# Altium project CartApuce.PrjPcb (part 2 of 2)

## Sheet CaP_CDC.SchDoc
size A2; Author: Audran; CompanyName: Goldorak; Address1: Electrolab; Address2: 52 rue Paul Lescop; Address3: 92000 Nanterre; ProjectName: Cartes_2017
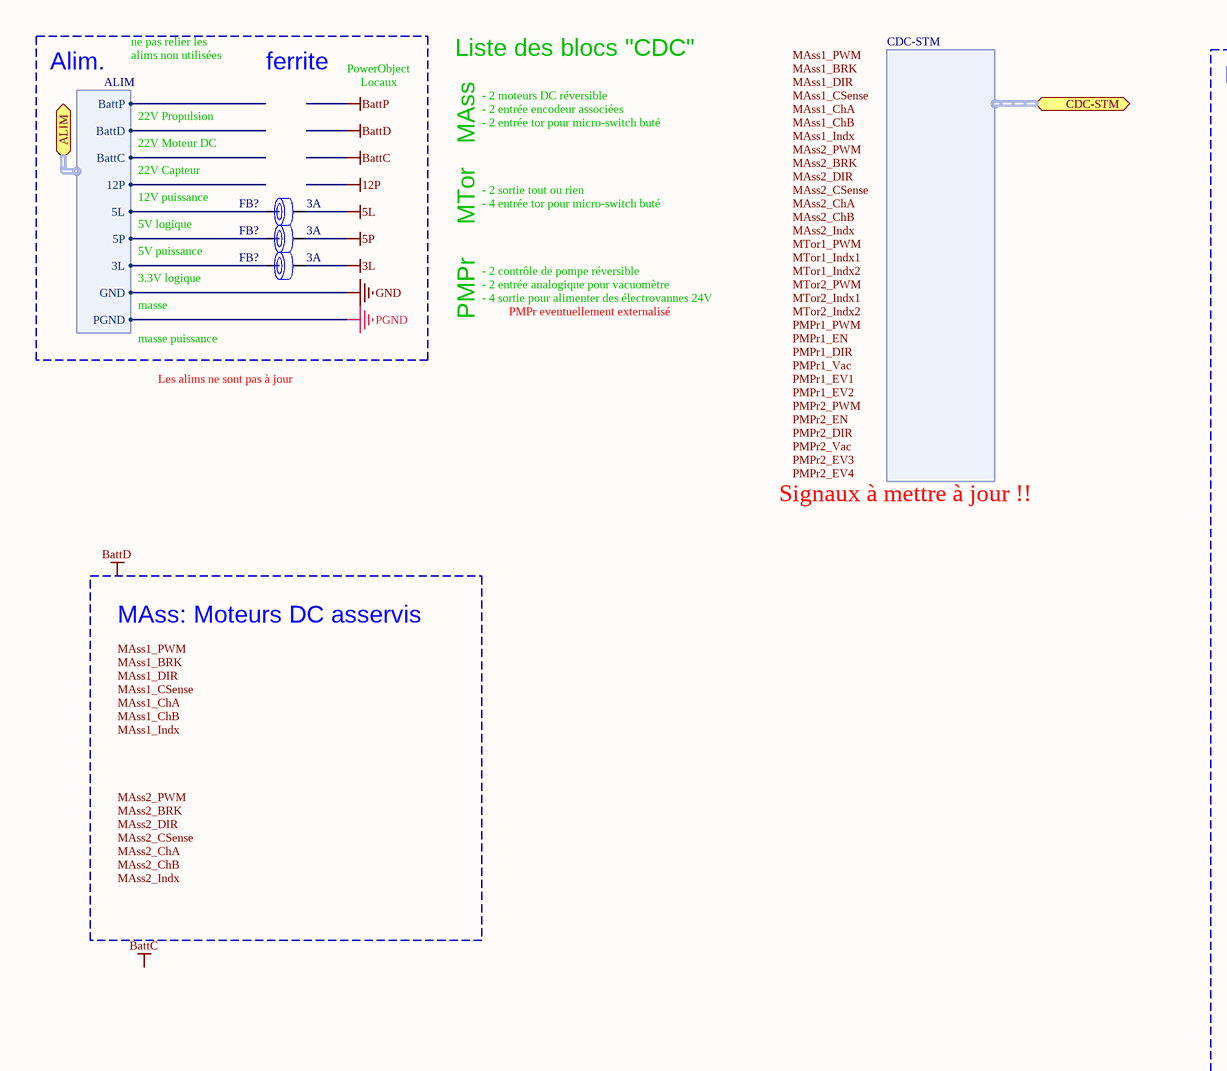
[diagram p4: CaP_CDC.SchDoc, left]
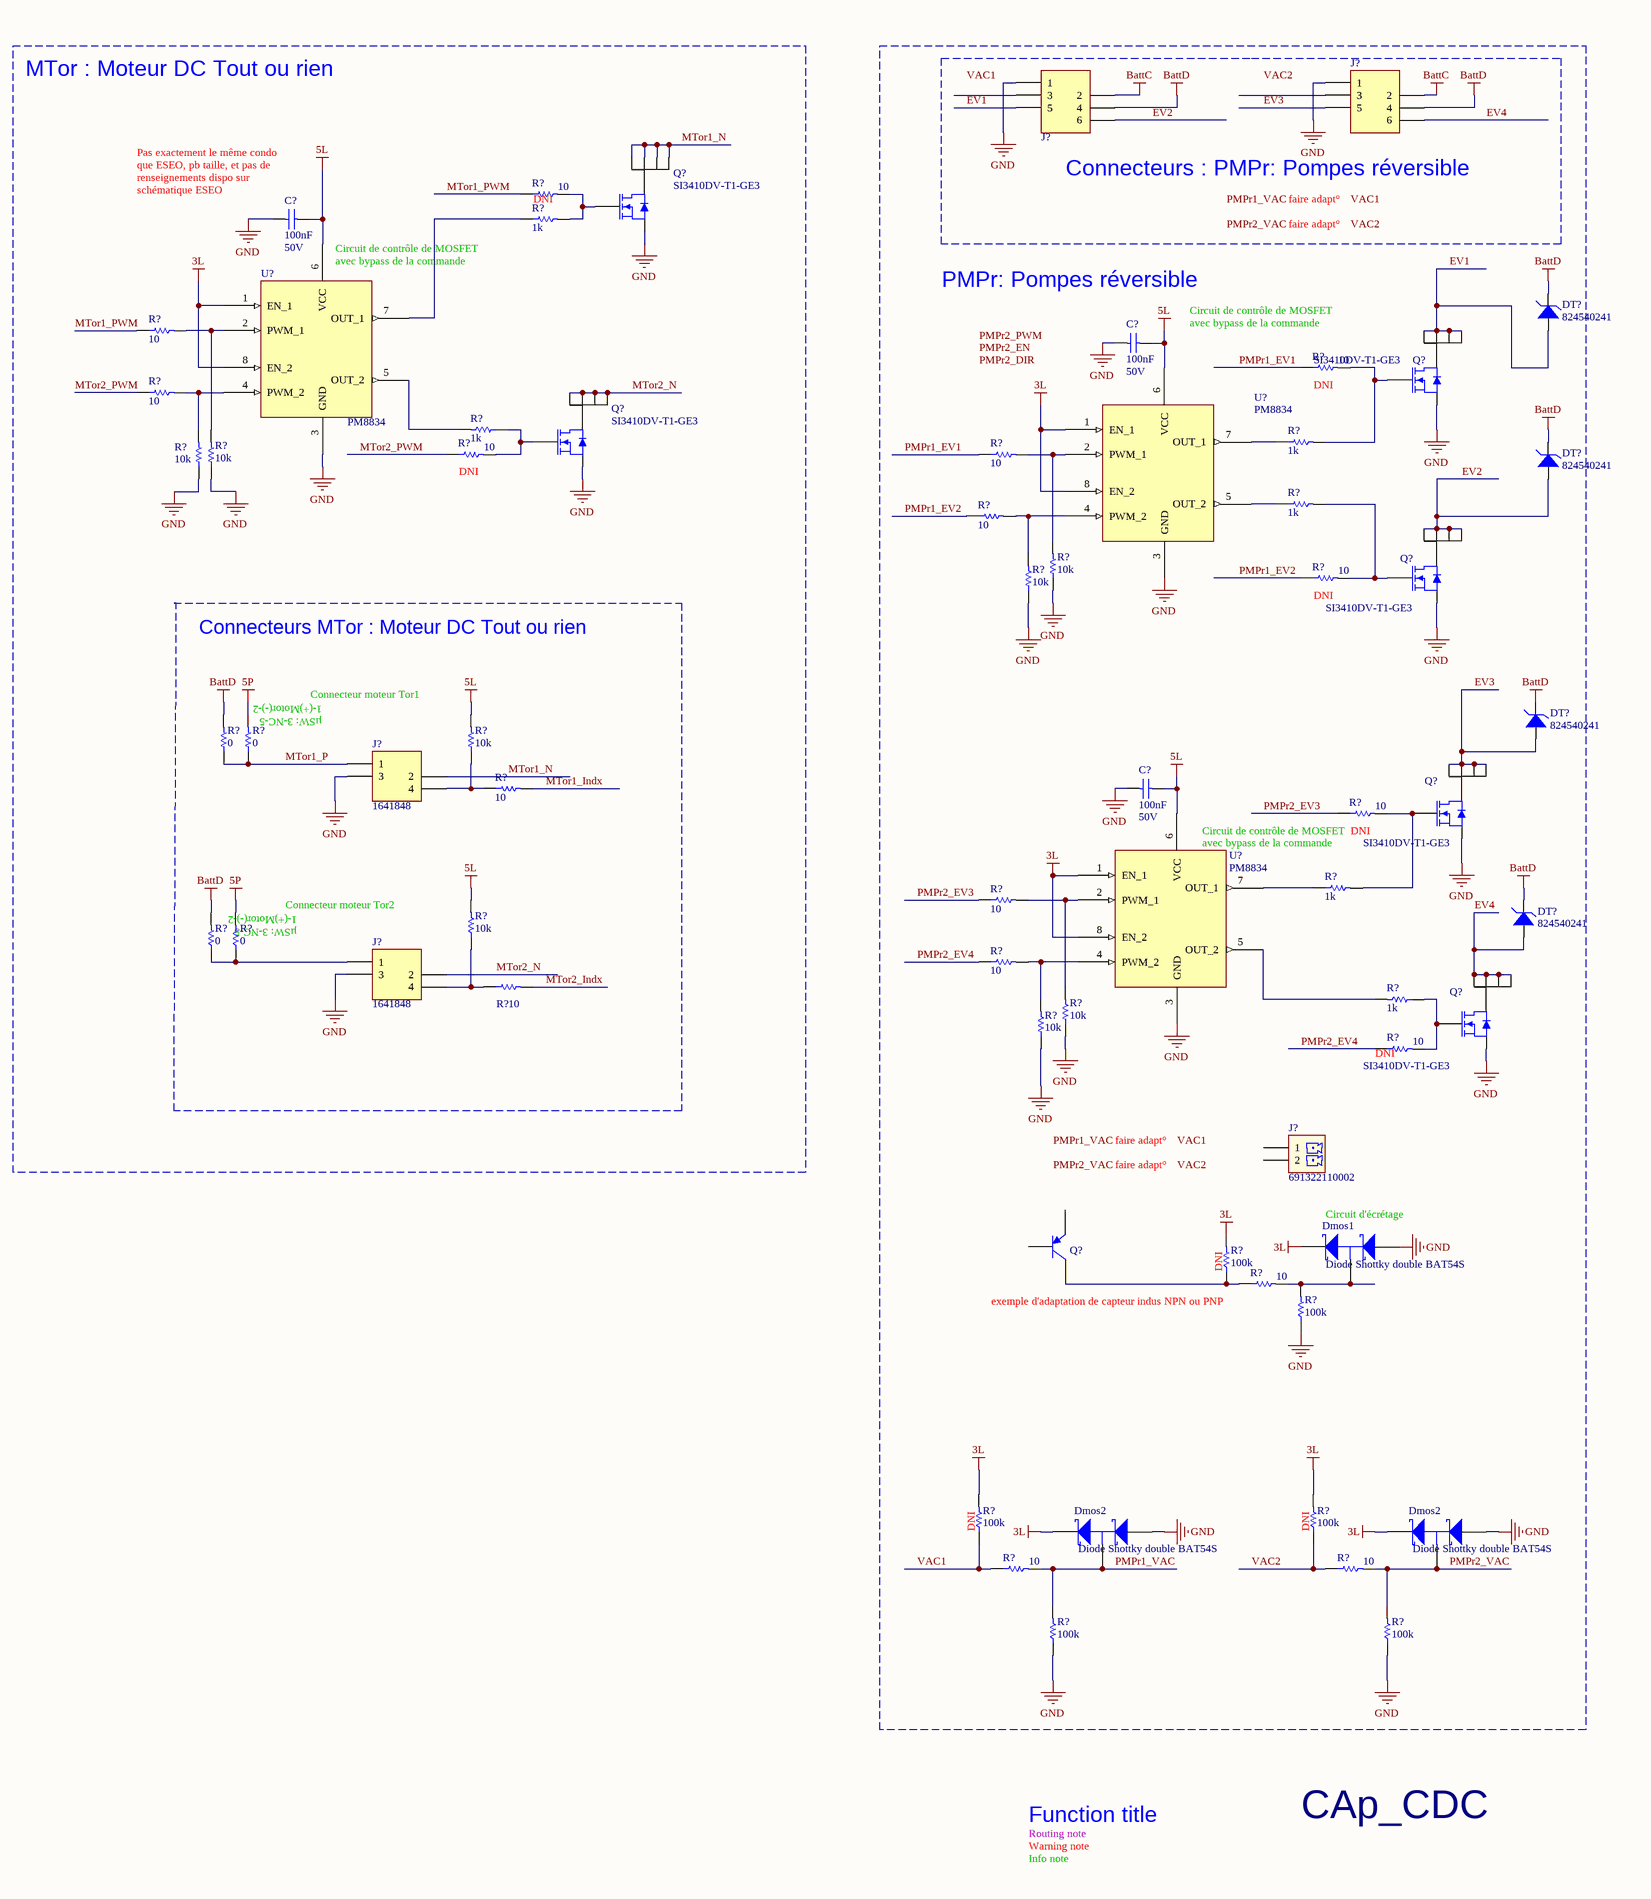
[diagram p5: CaP_CDC.SchDoc, right]

### Parts
(Parts that share a designator on the sheet are numbered #1, #2 ... from top to bottom, then left to right.)
C?#16  100nF  RatedVoltage: 50V  [WCAP-CSGP_0603, 1.6x0.8x0.8]
C?#17  100nF  RatedVoltage: 50V  [WCAP-CSGP_0603, 1.6x0.8x0.8]
C?#18  100nF  RatedVoltage: 50V  [WCAP-CSGP_0603, 1.6x0.8x0.8]
Dmos1  Diode Shottky double BAT54S  [SOT23-3N]
Dmos2#1  Diode Shottky double BAT54S  [SOT23-3N]
Dmos2#2  Diode Shottky double BAT54S  [SOT23-3N]
DT?#1  824540241  [DO-214AB_Unidirectional]
DT?#2  824540241  [DO-214AB_Unidirectional]
DT?#3  824540241  [DO-214AB_Unidirectional]
DT?#4  824540241  [DO-214AB_Unidirectional]
FB?#1  RatedCurrent: 3A  [WE-CBF_0805_High Current]  (hidden comment: 742792023)
FB?#2  RatedCurrent: 3A  [WE-CBF_0805_High Current]  (hidden comment: 742792023)
FB?#3  RatedCurrent: 3A  [WE-CBF_0805_High Current]  (hidden comment: 742792023)
J?#2  690367280676  [690367280676]  (value not drawn)
J?#3  690367280676  [690367280676]  (value not drawn)
J?#4  Supplier Part Number 1: 1641848  [690367280476]  (hidden comment: 690367280476)
J?#5  Supplier Part Number 1: 1641848  [690367280476]  (hidden comment: 690367280476)
J?#6  691322110002  [691322110002]
Q?#1  SI3410DV-T1-GE3  [TSOP95P280X110-6N]
Q?#2  SI3410DV-T1-GE3  [TSOP95P280X110-6N]
Q?#3  SI3410DV-T1-GE3  [TSOP95P280X110-6N]
Q?#4  SI3410DV-T1-GE3  [TSOP95P280X110-6N]
Q?#5  SI3410DV-T1-GE3  [TSOP95P280X110-6N]
Q?#6  SI3410DV-T1-GE3  [TSOP95P280X110-6N]
Q?#7  NSS20200LT1G  [SOT-23]  (value not drawn)
R?#42  value 10  [RESC1005X04N]  (hidden comment: RC0402FR-0710RL)
R?#43  value 1k  [RESC1608X06N]  (hidden comment: RC0603FR-071KL)
R?#44  value 10  [RESC1005X04N]  (hidden comment: RC0402FR-0710RL)
R?#45  value 10  [RESC1005X04N]  (hidden comment: RC0402FR-0710RL)
R?#46  value 10  [RESC1005X04N]  (hidden comment: RC0402FR-0710RL)
R?#47  value 1k  [RESC1608X06N]  (hidden comment: RC0603FR-071KL)
R?#48  value 1k  [RESC1005X04N]  (hidden comment: RC0402FR-071KL)
R?#49  value 10  [RESC1005X04N]  (hidden comment: RC0402FR-0710RL)
R?#50  value 10  [RESC1005X04N]  (hidden comment: RC0402FR-0710RL)
R?#51  value 10k  [RESC1005X04N]  (hidden comment: RC0402FR-0710KL)
R?#52  value 10k  [RESC1005X04N]  (hidden comment: RC0402FR-0710KL)
R?#53  value 1k  [RESC1005X04N]  (hidden comment: RC0402FR-071KL)
R?#54  value 10  [RESC1005X04N]  (hidden comment: RC0402FR-0710RL)
R?#55  value 10  [RESC1005X04N]  (hidden comment: RC0402FR-0710RL)
R?#56  value 10k  [RESC1005X04N]  (hidden comment: RC0402FR-0710KL)
R?#57  value 10k  [RESC1005X04N]  (hidden comment: RC0402FR-0710KL)
R?#58  value 0  [RESC1005X04N]  (hidden comment: RC0402JR-070RL)
R?#59  value 0  [RESC1005X04N]  (hidden comment: RC0402JR-070RL)
R?#60  value 10k  [RESC1005X04N]  (hidden comment: RC0402FR-0710KL)
R?#61  value 10  [RESC1005X04N]  (hidden comment: RC0402FR-0710RL)
R?#62  value 10  [RESC1005X04N]  (hidden comment: RC0402FR-0710RL)
R?#63  value 1k  [RESC1005X04N]  (hidden comment: RC0402FR-071KL)
R?#64  value 10  [RESC1005X04N]  (hidden comment: RC0402FR-0710RL)
R?#65  value 10k  [RESC1005X04N]  (hidden comment: RC0402FR-0710KL)
R?#66  value 0  [RESC1005X04N]  (hidden comment: RC0402JR-070RL)
R?#67  value 0  [RESC1005X04N]  (hidden comment: RC0402JR-070RL)
R?#68  value 10  [RESC1005X04N]  (hidden comment: RC0402FR-0710RL)
R?#69  value 10  [RESC1005X04N]  (hidden comment: RC0402FR-0710RL)
R?#70  value 1k  [RESC1608X06N]  (hidden comment: RC0603FR-071KL)
R?#71  value 10k  [RESC1005X04N]  (hidden comment: RC0402FR-0710KL)
R?#72  value 10k  [RESC1005X04N]  (hidden comment: RC0402FR-0710KL)
R?#73  value 10  [RESC1005X04N]  (hidden comment: RC0402FR-0710RL)
R?#74  value 100k  [RESC1608X06N]  (hidden comment: RC0603FR-07100KL)
R?#75  value 10  [RESC1005X04N]  (hidden comment: RC0402FR-0710RL)
R?#76  value 100k  [RESC1608X06N]  (hidden comment: RC0603FR-07100KL)
R?#77  value 100k  [RESC1608X06N]  (hidden comment: RC0603FR-07100KL)
R?#78  value 100k  [RESC1608X06N]  (hidden comment: RC0603FR-07100KL)
R?#79  value 10  [RESC1005X04N]  (hidden comment: RC0402FR-0710RL)
R?#80  value 10  [RESC1005X04N]  (hidden comment: RC0402FR-0710RL)
R?#81  value 100k  [RESC1608X06N]  (hidden comment: RC0603FR-07100KL)
R?#82  value 100k  [RESC1608X06N]  (hidden comment: RC0603FR-07100KL)
U?#1  PM8834  [SOIC127P600X175-8N]
U?#2  PM8834  [SOIC127P600X175-8N]
U?#3  PM8834  [SOIC127P600X175-8N]

### Blocks framed on the sheet
PMPr: Pompes réversible: C?#17 C?#18 Dmos1 Dmos2#1 Dmos2#2 DT?#1-DT?#4 J?#6 Q?#2 Q?#4-Q?#7 R?#45 R?#48 R?#50 R?#53-R?#57 R?#62-R?#64 R?#68 R?#70-R?#82 U?#2 U?#3
Connecteurs : PMPr: Pompes réversible: J?#2 J?#3
Connecteurs MTor : Moteur DC Tout ou rien: J?#4 J?#5 R?#58-R?#61 R?#65-R?#67 R?#69

### Ports
ALIM (harness ALIM), CDC-STM (harness CDC-STM)

### Harnesses
CDC-STM: 
ALIM: BattP, BattD, BattC, 12P, 5L, 5P, 3L, GND, PGND

### Nets
3L: Dmos1.2(K) Dmos2#1.2(K) Dmos2#2.2(K) FB?#3.2 R?#74.2 R?#77.2 R?#78.2 U?#1.1(EN_1) U?#1.8(EN_2) U?#2.1(EN_1) U?#2.8(EN_2) U?#3.1(EN_1) U?#3.8(EN_2)
5L: C?#16.2 C?#17.2 C?#18.2 FB?#1.2 R?#60.2 R?#65.2 U?#1.6(VCC) U?#2.6(VCC) U?#3.6(VCC)
5P: FB?#2.2 R?#59.2 R?#67.2
BattC: J?#2.2 J?#3.2
BattD: DT?#1.2 DT?#2.2 DT?#3.2 DT?#4.2 J?#2.4 J?#3.4 R?#58.2 R?#66.2
GND: C?#16.1 C?#17.1 C?#18.1 Dmos1.1(A) Dmos2#1.1(A) Dmos2#2.1(A) J?#2.1 J?#3.1 J?#4.3 J?#5.3 Q?#1.4(S) Q?#2.4(S) Q?#3.4(S) Q?#4.4(S) Q?#5.4(S) Q?#6.4(S) R?#51.1 R?#52.1 R?#56.1 R?#57.1 R?#71.1 R?#72.1 R?#76.1 R?#81.1 R?#82.1 U?#1.3(GND) U?#2.3(GND) U?#3.3(GND) ; port ALIM.GND
EV1: DT?#1.1 J?#2.5 Q?#2.1(D) Q?#2.2(D) Q?#2.5(D) Q?#2.6(D)
EV2: DT?#2.1 J?#2.6 Q?#4.1(D) Q?#4.2(D) Q?#4.5(D) Q?#4.6(D)
EV3: DT?#3.1 J?#3.5 Q?#5.1(D) Q?#5.2(D) Q?#5.5(D) Q?#5.6(D)
EV4: DT?#4.1 J?#3.6 Q?#6.1(D) Q?#6.2(D) Q?#6.5(D) Q?#6.6(D)
MTor1_Indx: R?#61.2
MTor1_N: J?#4.2 Q?#1.1(D) Q?#1.2(D) Q?#1.5(D) Q?#1.6(D)
MTor1_P: J?#4.1 R?#58.1 R?#59.1
MTor1_PWM: R?#42.1 R?#44.1
MTor2_Indx: R?#69.2
MTor2_N: J?#5.2 Q?#3.1(D) Q?#3.2(D) Q?#3.5(D) Q?#3.6(D)
MTor2_PWM: R?#46.1 R?#49.1
PMPr1_EV1: R?#45.1 R?#50.1
PMPr1_EV2: R?#54.1 R?#55.1
PMPr1_VAC: Dmos2#1.3(C) R?#79.2 R?#81.2
PMPr2_EV3: R?#62.1 R?#64.1
PMPr2_EV4: R?#68.1 R?#73.1
PMPr2_VAC: Dmos2#2.3(C) R?#80.2 R?#82.2
VAC1: R?#77.1 R?#79.1
VAC2: R?#78.1 R?#80.1
NetDmos1_3: Dmos1.3(C) R?#75.2 R?#76.2
NetFB?#1_1: FB?#1.1 ; port ALIM.5L
NetFB?#2_1: FB?#2.1 ; port ALIM.5P
NetFB?#3_1: FB?#3.1 ; port ALIM.3L
NetJ?#4_4: J?#4.4 R?#60.1 R?#61.1
NetJ?#5_1: J?#5.1 R?#66.1 R?#67.1
NetJ?#5_4: J?#5.4 R?#65.1 R?#69.1
NetQ?#1_3: Q?#1.3(G) R?#42.2 R?#43.2
NetQ?#2_3: Q?#2.3(G) R?#45.2 R?#48.2
NetQ?#3_3: Q?#3.3(G) R?#47.1 R?#49.2
NetQ?#4_3: Q?#4.3(G) R?#53.2 R?#55.2
NetQ?#5_3: Q?#5.3(G) R?#62.2 R?#63.2
NetQ?#6_3: Q?#6.3(G) R?#70.1 R?#73.2
NetQ?#7_3: Q?#7.3(C) R?#74.1 R?#75.1
NetR?#43_1: R?#43.1 U?#1.7(OUT_1)
NetR?#44_2: R?#44.2 R?#52.2 U?#1.2(PWM_1)
NetR?#46_2: R?#46.2 R?#51.2 U?#1.4(PWM_2)
NetR?#47_2: R?#47.2 U?#1.5(OUT_2)
NetR?#48_1: R?#48.1 U?#2.7(OUT_1)
NetR?#50_2: R?#50.2 R?#56.2 U?#2.2(PWM_1)
NetR?#53_1: R?#53.1 U?#2.5(OUT_2)
NetR?#54_2: R?#54.2 R?#57.2 U?#2.4(PWM_2)
NetR?#63_1: R?#63.1 U?#3.7(OUT_1)
NetR?#64_2: R?#64.2 R?#71.2 U?#3.2(PWM_1)
NetR?#68_2: R?#68.2 R?#72.2 U?#3.4(PWM_2)
NetR?#70_2: R?#70.2 U?#3.5(OUT_2)

Not connected (* = marked no-connect by the designer): J?#2 3; J?#3 3; J?#6 1 2; Q?#7 1(B) 2(E)

### Notes on the sheet
- Alim.
- ne pas relier les
- alims non utilisées
- ferrite
- PowerObject
- Locaux
- Liste des blocs "CDC"
- - 2 moteurs DC réversible
- MTor : Moteur DC Tout ou rien
- 22V Propulsion
- 22V Moteur DC
- - 2 entrée encodeur associées
- - 2 entrée tor pour micro-switch buté
- MAss
- 5V logique
- 12V puissance
- 22V Capteur
- - 2 sortie tout ou rien
- - 4 entrée tor pour micro-switch buté
- MTor
- (near C?#16) Pas exactement le même condo que ESEO, pb taille, et pas de renseignements dispo sur schématique ESEO
- (near R?#42) DNI
- faire adapt°
- 5V puissance
- 3.3V logique
- - 2 contrôle de pompe réversible
- - 2 entrée analogique pour vacuomètre
- - 4 sortie pour alimenter des électrovannes 24V
- (near U?#1) Circuit de contrôle de MOSFET
- (near U?#1) avec bypass de la commande
- masse
- masse puissance
- PMPr
- PMPr eventuellement externalisé
- Circuit de contrôle de MOSFET
- avec bypass de la commande
- Les alims ne sont pas à jour
- (near R?#45) DNI
- Signaux à mettre à jour !!
- (near R?#49) DNI
- MAss: Moteurs DC asservis
- (near R?#55) DNI
- Connecteur moteur Tor1
- 1-(+)Motor(-)-2
- (near J?#4) µSW: 3-NC-5
- (near R?#62) DNI
- (near U?#3) avec bypass de la commande
- Connecteur moteur Tor2
- (near J?#5) 1-(+)Motor(-)-2
- (near J?#5) µSW: 3-NC-5
- (near R?#73) DNI
- (near R?#74) DNI
- (near Dmos1) Circuit d'écrétage
- (near R?#75) exemple d'adaptation de capteur indus NPN ou PNP
- (near R?#77) DNI
- (near R?#78) DNI
- Function title
- CAp_CDC
- Routing note
- Warning note
- Info note
- Labels drawn without touching a wire or pin: BattC, BattD, MAss1_BRK, MAss1_ChA, MAss1_ChB, MAss1_CSense, MAss1_DIR, MAss1_Indx, MAss1_PWM, MAss2_BRK, MAss2_ChA, MAss2_ChB, MAss2_CSense, MAss2_DIR, MAss2_Indx, MAss2_PWM, MTor1_Indx1, MTor1_Indx2, MTor1_PWM, MTor2_Indx1, MTor2_Indx2, MTor2_PWM, PMPr1_DIR, PMPr1_EN, PMPr1_EV1, PMPr1_EV2, PMPr1_PWM, PMPr1_Vac, PMPr1_VAC, PMPr2_DIR, PMPr2_EN, PMPr2_EV3, PMPr2_EV4, PMPr2_PWM, PMPr2_VAC, PMPr2_Vac, VAC1, VAC2

### Library data of the parts
C?#16-C?#18 = WCAP-CSGP, 885012206095: CAP CER 100nF 50V X7R 0603; Manufacturer: Wurth Elektronik; PublishedDate: Aug 2016; ComponentLink1Description: Manufacturer; ComponentLink1URL: http://www.we-online.de; ComponentLink2Description: Datasheet; ComponentLink2URL: http://katalog.we-online.com/pbs/datasheet/885012206095.pdf; Manufacturer Part Number: 885012206095; Value: 100nF; Size: 0603; CeramicType: X7R
Dmos1 Dmos2#1 Dmos2#2 = Diode Shottky double BAT54S: DIODE SCHOTTKY DOUBLE; Manufacturer: ZETEX; ComponentLink1URL: http://www.farnell.com/datasheets/27632.pdf; ComponentLink1Description: http://www.farnell.com/datasheets/27632.pdf; Supplier: Farnell; RoHS: YES; Supplier Part Number: 9526510; Pricing: 5=0,32, 25=0,26, 100=0,21, 1000=0,17 (EUR); Manufacturer Part Number: BAT54S
DT?#1-DT?#4 = 824540241: WE-TVSP Power TVS Diode, Unidirectional, 1500 W, 24 VDC; Manufacturer: Wurth Electronics Inc.; Supplier 1: Farnell; Supplier Part Number 1: 2536699; Manufacturer Part Number: 824540241; ComponentLink1URL: http://katalog.we-online.de/pbs/datasheet/824540241.pdf; ComponentLink1Description: Datasheet
FB?#1-FB?#3 = WE-CBF, 742792023: Ferrite Bead 120ohm 0805 max3.0A; Manufacturer: Wurth Elektronik; Value: 120Ω; Type: High Current; PublishedDate: Aug 2016; ComponentLink1Description: Manufacturer; ComponentLink1URL: http://www.we-online.de; ComponentLink2Description: Datasheet; ComponentLink2URL: http://katalog.we-online.de/pbs/datasheet/742792023.pdf; Manufacturer Part Number: 742792023; Size: 0805
J?#2 J?#3 = 690367280676: WR-MM 6p Female SMT Connector with Polarization; Manufacturer: Wurth Electronics Inc.; Value: 6; ComponentLink1URL: http://www.we-online.com; ComponentLink1Description: Manufacturer; ComponentLink2URL: http://katalog.we-online.de/em/datasheet/69036728xx76.pdf; ComponentLink2Description: Datasheet; Manufacturer Part Number: 690367280676; Supplier 1: Farnell; Supplier Part Number 1: 1641849
J?#4 J?#5 = 690367280476: WR-MM 4p Female SMT Connector with Polarization; Manufacturer: Wurth Electronics Inc.; Value: 4; ComponentLink1URL: http://www.we-online.com; ComponentLink1Description: Manufacturer; ComponentLink2URL: http://katalog.we-online.de/em/datasheet/69036728xx76.pdf; ComponentLink2Description: Datasheet; Manufacturer Part Number: 690367280476; Supplier 1: Farnell
J?#6 = 691322110002: TERM BLOCK HDR 2POS 90DEG 3.5MM; Manufacturer: Wurth Electronics Inc.; Value: 2; Supplier 1: Farnell; Manufacturer Part Number: 691322110002; ComponentLink1URL: http://www.we-online.com; Supplier Part Number 1: 1841315; ComponentLink1Description: Manufacturer; ComponentLink2Description: Datasheet; ComponentLink2URL: http://katalog.we-online.de/em/datasheet/6913221100xx.pdf
Q?#1-Q?#6 = SI3410DV-T1-GE3: MOSFET N-CH 30V 8A 6-TSOP; Manufacturer: Vishay Siliconix; Supplier 1: Farnell; Supplier Part Number 1: 2454803; Manufacturer Part Number: SI3410DV-T1-GE3; ComponentLink1URL: http://www.vishay.com/docs/69254/si3410dv.pdf; ComponentLink1Description: Datasheet
Q?#7 = NSS20200LT1G: NSS20200LT1G PNP; Manufacturer 1: ON SEMICONDUCTOR; ComponentLink1Description: http://www.onsemi.com/pub_link/Collateral/NSS20200L-D.PDF; ComponentLink1URL: http://www.onsemi.com/pub_link/Collateral/NSS20200L-D.PDF; Supplier 1: Farnell; Supplier Part Number 1: 1887110; Manufacturer Part Number: NSS20200LT1G
R?#42 R?#44-R?#46 R?#49 R?#50 R?#54 R?#55 R?#61 R?#62 R?#64 R?#68 R?#69 R?#73 R?#75 R?#79 R?#80 = RC0402FR-0710RL: RES SMD 10 OHM 1% 1/16W 0402; Manufacturer: Yageo; Power: 63mW; Vmax: 50V; Type: Thick Film; ComponentLink1Description: Manufacturer; ComponentLink1URL: http://www.yageo.com/NewPortal/_en/index.jsp; ComponentLink2Description: Datasheet; ComponentLink2URL: http://www.farnell.com/datasheets/1018594.pdf; Manufacturer Part Number: RC0402FR-0710RL; Supplier 1: Farnell; Supplier Part Number 1: 9238999; Precision: ±1%
R?#43 R?#47 R?#70 = RC0603FR-071KL: RES SMD 1K OHM 1% 1/10W 0603; Manufacturer: Yageo; Power: 100mW; Vmax: 50V; Manufacturer Part Number: RC0603FR-071KL; Type: Thick Film; ComponentLink1Description: Manufacturer; ComponentLink1URL: http://www.yageo.com/NewPortal/_en/index.jsp; ComponentLink2Description: Datasheet; ComponentLink2URL: http://www.farnell.com/datasheets/2167052.pdf; Precision: ±1%; Supplier 1: Farnell; Supplier Part Number 1: 9238484
R?#48 R?#53 R?#63 = RC0402FR-071KL: RES SMD 1K OHM 1% 1/16W 0402; Manufacturer: Yageo; Power: 63mW; Vmax: 50V; Type: Thick Film; ComponentLink1Description: Manufacturer; ComponentLink1URL: http://www.yageo.com/NewPortal/_en/index.jsp; ComponentLink2Description: Datasheet; ComponentLink2URL: http://www.farnell.com/datasheets/2167052.pdf; Manufacturer Part Number: RC0402FR-071KL; Supplier 1: Farnell; Supplier Part Number 1: 9239235; Precision: ±1%
R?#51 R?#52 R?#56 R?#57 R?#60 R?#65 R?#71 R?#72 = RC0402FR-0710KL: RES SMD 10K OHM 1% 1/16W 0402; Manufacturer: Yageo; Power: 63mW; Vmax: 50V; Type: Thick Film; ComponentLink1Description: Manufacturer; ComponentLink1URL: http://www.yageo.com/NewPortal/_en/index.jsp; ComponentLink2Description: Datasheet; ComponentLink2URL: http://www.farnell.com/datasheets/2167052.pdf; Supplier 1: Farnell; Supplier Part Number 1: 9239359; Manufacturer Part Number: RC0402FR-0710KL; Precision: ±1%
R?#58 R?#59 R?#66 R?#67 = RC0402JR-070RL: RES SMD 0 OHM 5% 1/16W 0402; Manufacturer: Yageo; Power: 63mW; Vmax: 50V; Type: Thick Film; ComponentLink1Description: Manufacturer; ComponentLink1URL: http://www.yageo.com/NewPortal/_en/index.jsp; ComponentLink2Description: Datasheet; ComponentLink2URL: http://www.farnell.com/datasheets/1018594.pdf; Manufacturer Part Number: RC0402JR-070RL; Supplier 1: Farnell; Supplier Part Number 1: 9232516; Precision: ±5%
R?#74 R?#76-R?#78 R?#81 R?#82 = RC0603FR-07100KL: RES SMD 100K OHM 1% 1/10W 0603; Manufacturer: Yageo; Power: 100mW; Vmax: 50V; Manufacturer Part Number: RC0603FR-07100KL; Type: Thick Film; ComponentLink1Description: Manufacturer; ComponentLink1URL: http://www.yageo.com/NewPortal/_en/index.jsp; ComponentLink2Description: Datasheet; ComponentLink2URL: http://www.farnell.com/datasheets/2167052.pdf; Supplier 1: Farnell; Supplier Part Number 1: 2309107; Precision: ±1%
U?#1-U?#3 = PM8834: IC MOSFET DVR 4A DUAL 8SOIC; Manufacturer: STMicroelectronics; ComponentLink1URL: http://www.st.com/content/ccc/resource/technical/document/datasheet/9a/22/3e/55/d3/f8/46/d5/CD00212712.pdf/files/CD00212712.pdf/jcr:content/translations/en.CD00212712.pdf; ComponentLink1Description: Datasheet; Manufacturer Part Number: PM8834; Supplier 1: Digi-Key; Supplier Part Number 1: PM8834-ND

## Sheet CaP_STM.SchDoc
size A3; Author: Audran; CompanyName: Goldorak; Address1: Electrolab; Address2: 52 rue Paul Lescop; Address3: 92000 Nanterre; ProjectName: Cartes_2017
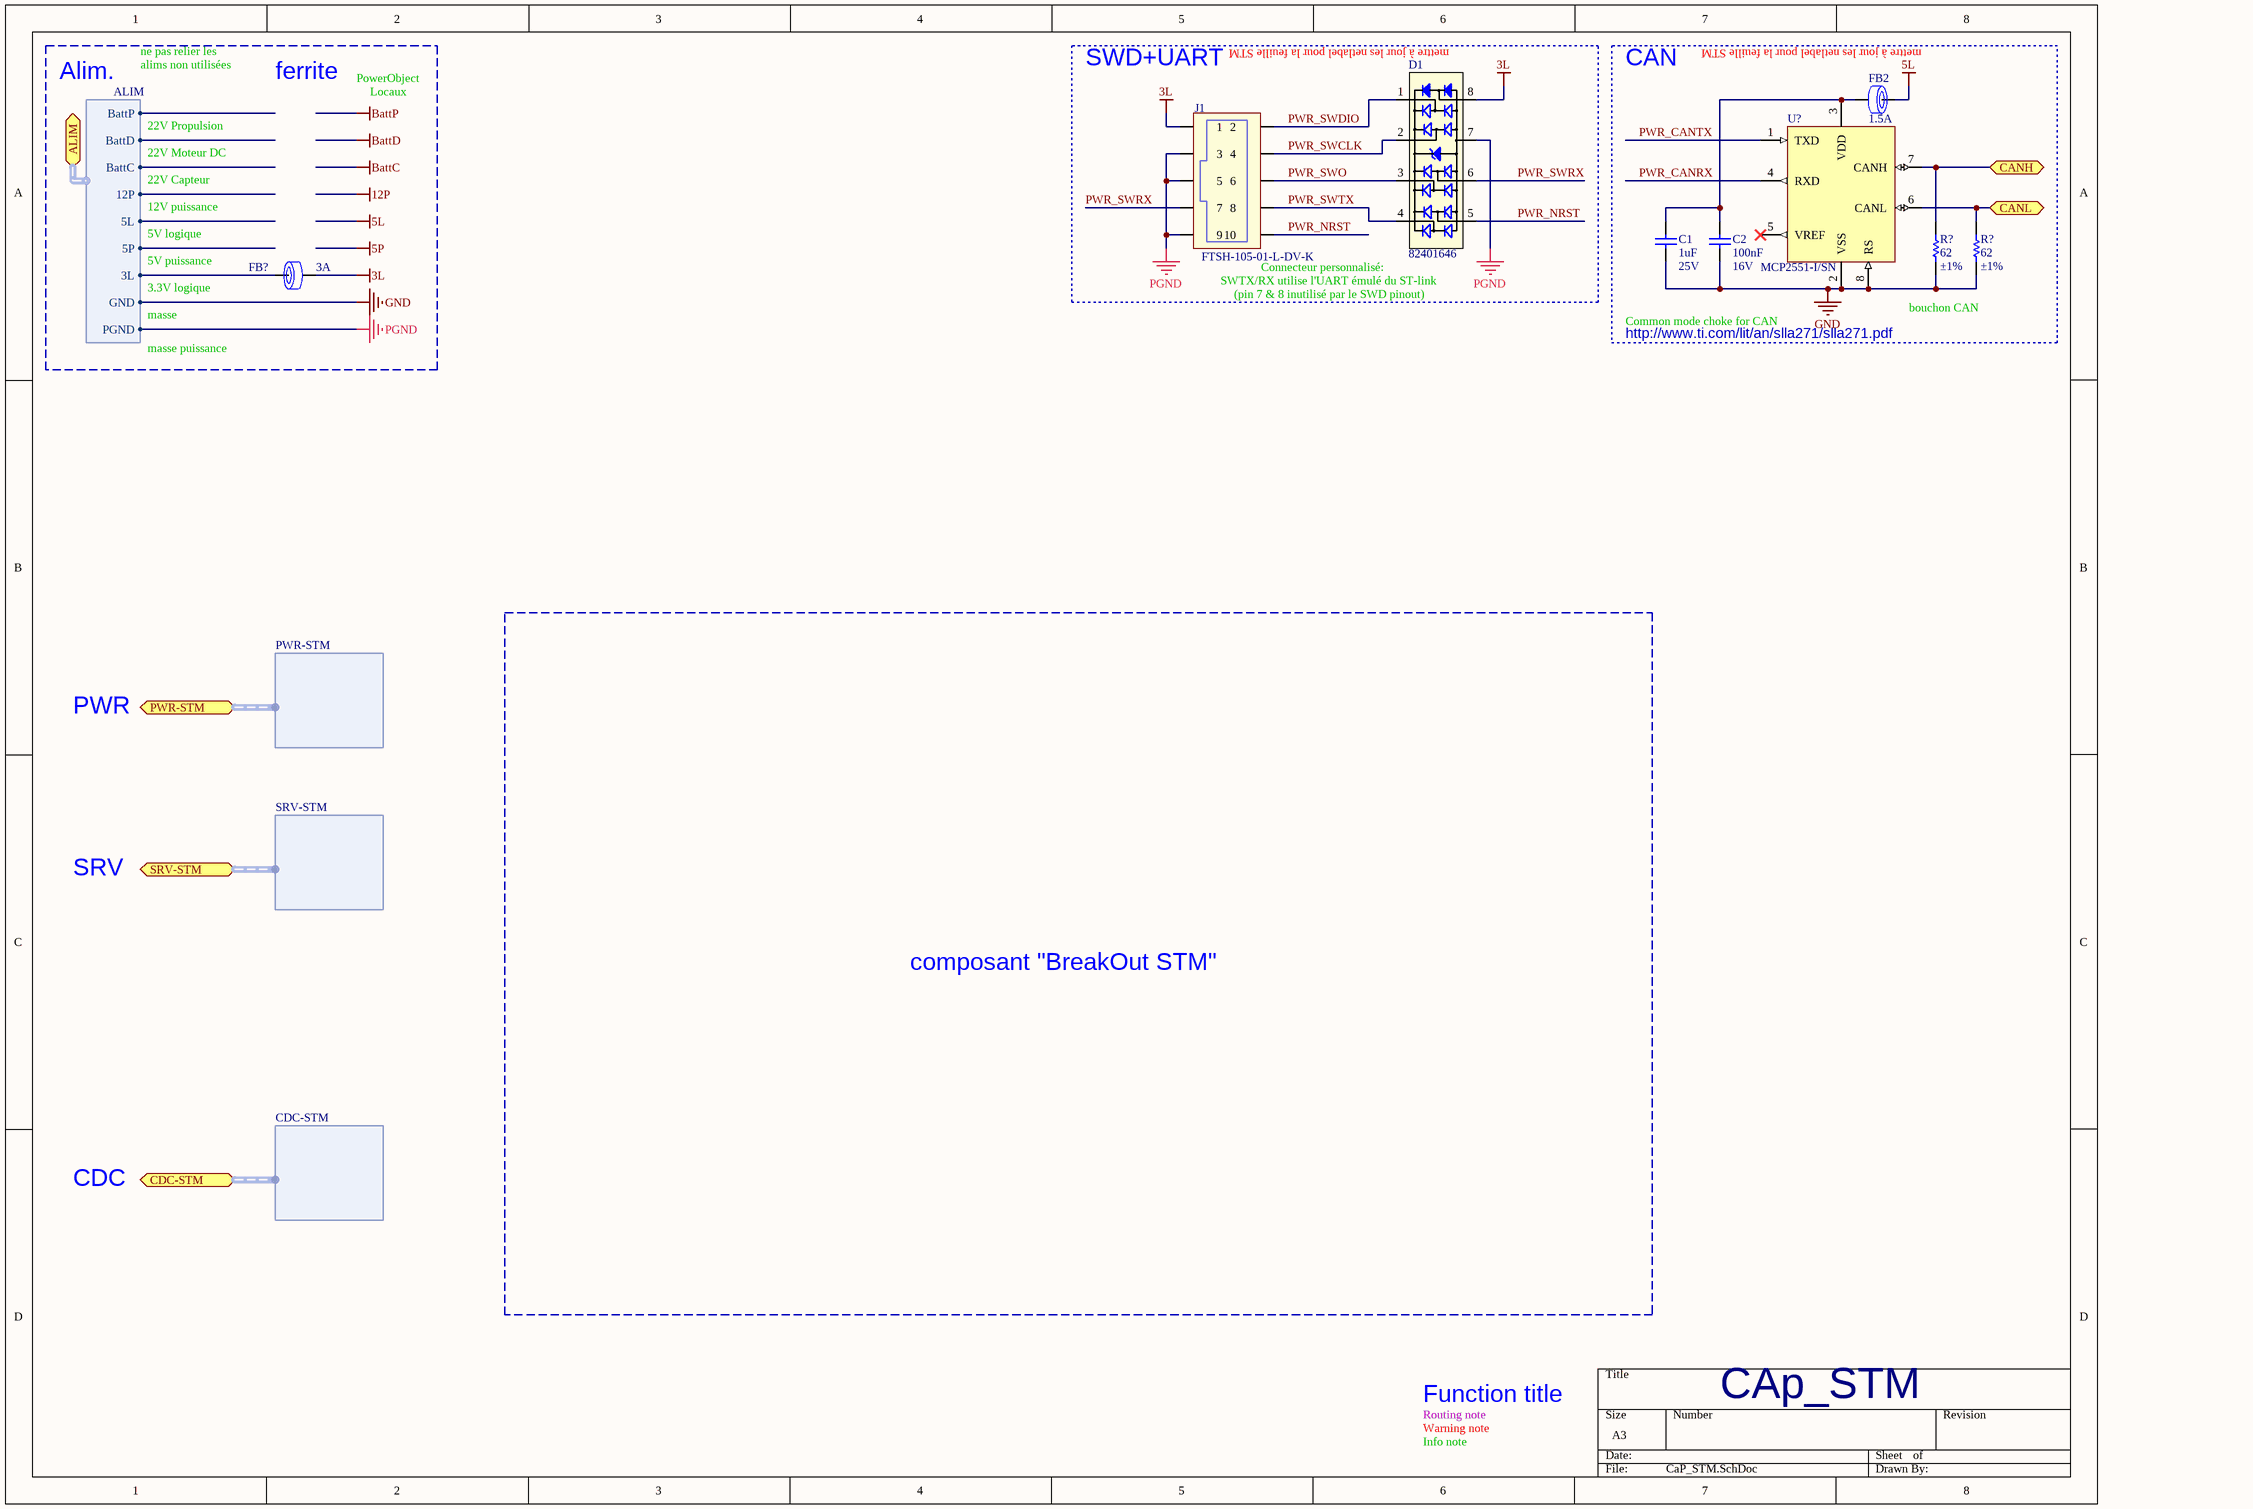
[diagram p6: CaP_STM.SchDoc]

### Parts
(Parts that share a designator on the sheet are numbered #1, #2 ... from top to bottom, then left to right.)
C1#2  1uF  RatedVoltage: 25V  [WCAP-CSGP_0603, 1.6x0.8x0.8]
C2#2  100nF  RatedVoltage: 16V  [WCAP-CSGP_0402, 1x0.5x0.5]
D1  82401646  [MSOP-8L]
FB2  RatedCurrent: 1.5A  [WE-CBF_0603_High Current]  (hidden comment: 742792624)
FB?#4  RatedCurrent: 3A  [WE-CBF_0805_High Current]  (hidden comment: 742792023)
J1  FTSH-105-01-L-DV-K  [FTSH-105-01-L-DV-K]
R?#83  value 62  Precision: ±1%  [RESC1005X04N]  (hidden comment: RC0402FR-0762RL)
R?#84  value 62  Precision: ±1%  [RESC1005X04N]  (hidden comment: RC0402FR-0762RL)
U?#4  MCP2551-I/SN  [SO8_N]

### Blocks framed on the sheet
SWD+UART: D1 J1
CAN: C1#2 C2#2 FB2 R?#83 R?#84 U?#4

### Ports
ALIM (harness ALIM), CANH, CANL, CDC-STM (harness CDC-STM), PWR-STM (harness PWR-STM), SRV-STM (harness SRV-STM)

### Harnesses
PWR-STM: 
SRV-STM: 
CDC-STM: 
ALIM: BattP, BattD, BattC, 12P, 5L, 5P, 3L, GND, PGND

### Nets
3L: D1.8 FB?#4.2 J1.1
5L: FB2.1
GND: C1#2.1 C2#2.1 R?#83.1 R?#84.1 U?#4.2(VSS) U?#4.8(RS) ; port ALIM.GND
PGND: D1.7 J1.3 J1.5 J1.9 ; port ALIM.PGND
PWR_CANRX: U?#4.4(RXD)
PWR_CANTX: U?#4.1(TXD)
PWR_NRST: D1.5 J1.10
PWR_SWCLK: D1.2 J1.4
PWR_SWDIO: D1.1 J1.2
PWR_SWO: D1.3 J1.6
PWR_SWRX: D1.6 J1.7
PWR_SWTX: D1.4 J1.8
NetC1#2_2: C1#2.2 C2#2.2 FB2.2 U?#4.3(VDD)
NetFB?#4_1: FB?#4.1 ; port ALIM.3L
NetR?#83_2: R?#83.2 U?#4.7(CANH) ; port CANH
NetR?#84_2: R?#84.2 U?#4.6(CANL) ; port CANL

Not connected (* = marked no-connect by the designer): U?#4 5(VREF)*

### Notes on the sheet
- (near D1) mettre à jour les netlabel pour la feuille STM
- (near FB2) mettre à jour les netlabel pour la feuille STM
- Alim.
- ne pas relier les
- alims non utilisées
- ferrite
- PowerObject
- Locaux
- 22V Propulsion
- 22V Moteur DC
- 22V Capteur
- 5V logique
- 12V puissance
- 5V puissance
- 3.3V logique
- masse
- SWTX/RX utilise l'UART émulé du ST-link
- (pin 7 & 8 inutilisé par le SWD pinout)
- Connecteur personnalisé:
- (near R?#83) bouchon CAN
- masse puissance
- http://www.ti.com/lit/an/slla271/slla271.pdf
- Common mode choke for CAN
- PWR
- SRV
- composant "BreakOut STM"
- CDC
- Routing note
- Warning note
- Info note
- Function title
- CAp_STM

### Library data of the parts
C1#2 = WCAP-CSGP, 885012206076: CAP CER 1uF 25V X7R 0603; Manufacturer: Wurth Elektronik; PublishedDate: Aug 2016; ComponentLink1Description: Manufacturer; ComponentLink1URL: http://www.we-online.de; ComponentLink2Description: Datasheet; ComponentLink2URL: http://katalog.we-online.com/pbs/datasheet/885012206076.pdf; Manufacturer Part Number: 885012206076; Value: 1uF; Size: 0603; CeramicType: X7R
C2#2 = WCAP-CSGP, 885012205037: CAP CER 100nF 16V X7R 0402; Manufacturer: Wurth Elektronik; PublishedDate: Aug 2016; ComponentLink1Description: Manufacturer; ComponentLink1URL: http://www.we-online.de; ComponentLink2Description: Datasheet; ComponentLink2URL: http://katalog.we-online.com/pbs/datasheet/885012205037.pdf; Value: 100nF; Size: 0402; CeramicType: X7R; Manufacturer Part Number: 885012205037
D1 = 82401646: TVS DIODE 5VWM 13VC 8MSOP; Manufacturer: Wurth Electronics Inc.; Supplier 1: Farnell; Manufacturer Part Number: 82401646; ComponentLink1URL: http://katalog.we-online.de/pbs/datasheet/82401646.pdf; ComponentLink1Description: Datasheet; Supplier Part Number 1: 1825864
FB2 = WE-CBF, 742792624: Ferrite Bead 180ohm 0603 max1.5A; Manufacturer: Wurth Elektronik; Value: 180Ω; Type: High Current; PublishedDate: Aug 2016; ComponentLink1Description: Manufacturer; ComponentLink1URL: http://www.we-online.de; ComponentLink2Description: Datasheet; ComponentLink2URL: http://katalog.we-online.de/pbs/datasheet/742792624.pdf; Manufacturer Part Number: 742792624; Size: 0603
FB?#4 = WE-CBF, 742792023: as FB?#1 on sheet CaP_CDC; PublishedDate: Aug 2016; ComponentLink1Description: Manufacturer; ComponentLink1URL: http://www.we-online.de; ComponentLink2Description: Datasheet; ComponentLink2URL: http://katalog.we-online.de/pbs/datasheet/742792023.pdf; Manufacturer Part Number: 742792023; Size: 0805
J1 = FTSH-105-01-L-DV-K: CONN HEADER 10 POS DUAL .05" SMD with Keying; Manufacturer: Samtec Inc.; Supplier 1: Digi-Key; Manufacturer Part Number: FTSH-105-01-L-DV-K; ComponentLink1URL: http://suddendocs.samtec.com/prints/ftsh-1xx-xx-xxx-dv-xxx-xxx-mkt.pdf; ComponentLink1Description: Datasheet; Supplier Part Number 1: SAM8799-ND
R?#83 R?#84 = RC0402FR-0762RL: RES SMD 62 OHM 1% 1/16W 0402; Manufacturer: Yageo; Power: 63mW; Vmax: 50V; Type: Thick Film; ComponentLink1Description: Manufacturer; ComponentLink1URL: http://www.yageo.com/NewPortal/_en/index.jsp; ComponentLink2Description: Datasheet; ComponentLink2URL: http://www.farnell.com/datasheets/2167052.pdf; Manufacturer Part Number: RC0402FR-0762RL; Supplier 1: Farnell; Supplier Part Number 1: 1458813
U?#4 = MCP2551-I/SN: IC TRANSCEIVER CAN HI-SPD 8-SOIC; Manufacturer: Microchip Technology; Manufacturer Part Number: MCP2551-I/SN; ComponentLink1Description: Datasheet; ComponentLink1URL: http://www.farnell.com/datasheets/657417.pdf; Supplier 1: Farnell; Supplier Part Number 1: 9758569

## Sheet CAp_Pont_H.SchDoc
size A3
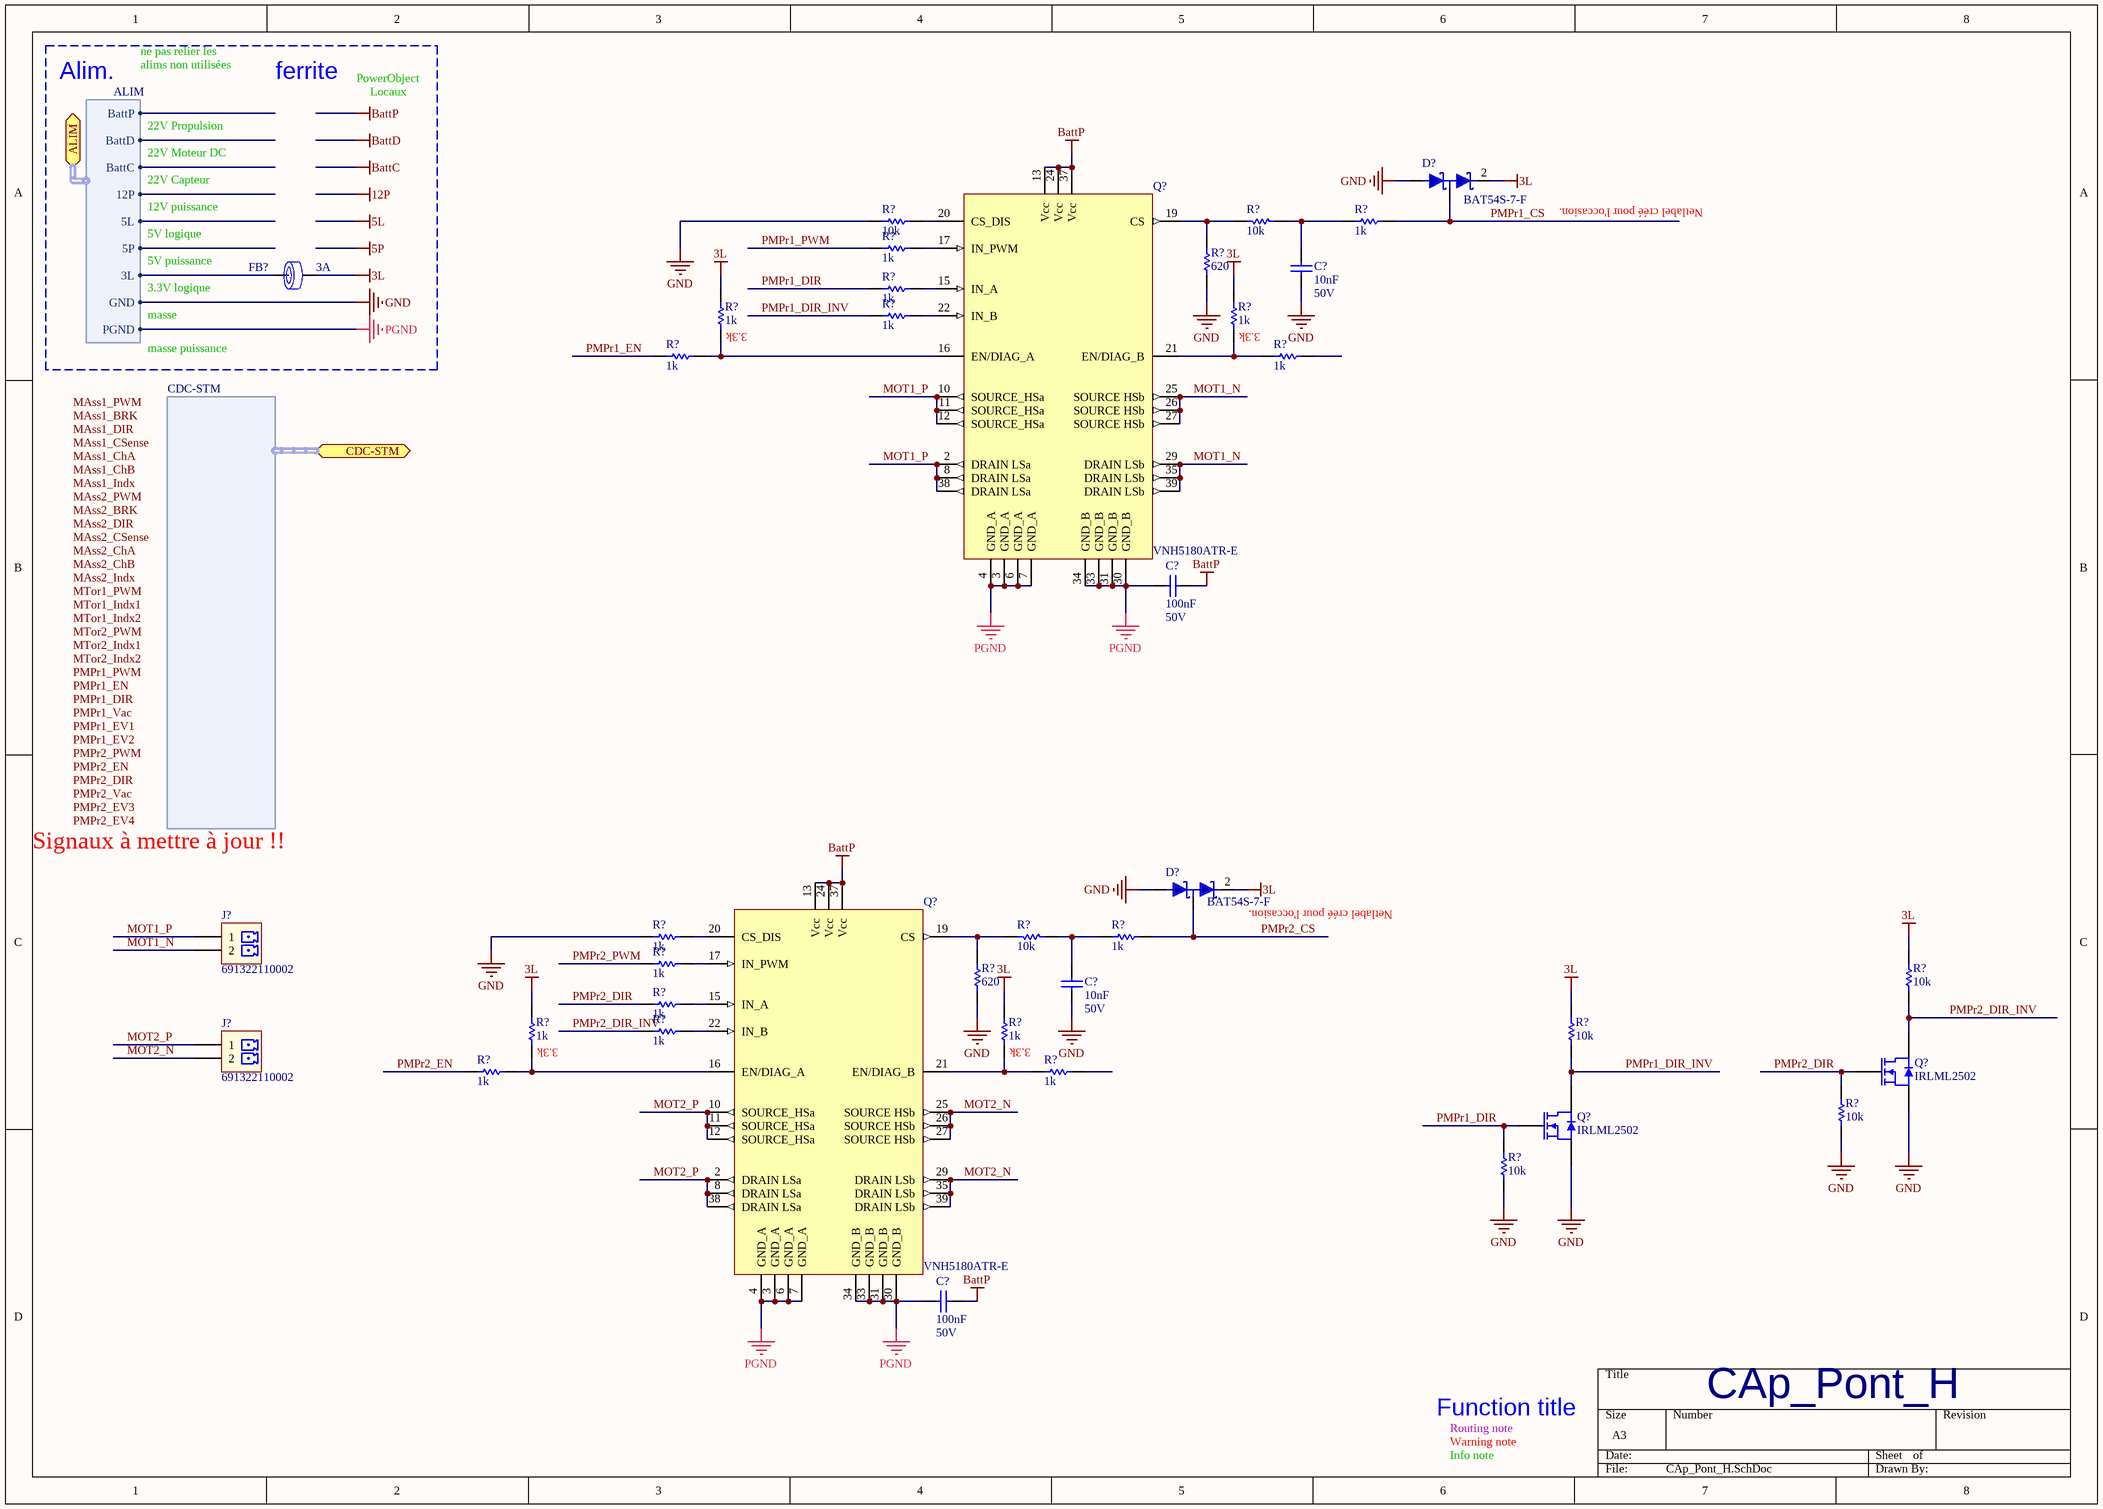
[diagram p7: CAp_Pont_H.SchDoc]

### Parts
(Parts that share a designator on the sheet are numbered #1, #2 ... from top to bottom, then left to right.)
C?#19  10nF  RatedVoltage: 50V  [WCAP-CSGP_0402, 1x0.5x0.5]
C?#20  100nF  RatedVoltage: 50V  [WCAP-CSGP_0603, 1.6x0.8x0.8]
C?#21  10nF  RatedVoltage: 50V  [WCAP-CSGP_0402, 1x0.5x0.5]
C?#22  100nF  RatedVoltage: 50V  [WCAP-CSGP_0603, 1.6x0.8x0.8]
D?#1  BAT54S-7-F  [SOT92P240X110-3N]
D?#2  BAT54S-7-F  [SOT92P240X110-3N]
FB?#5  RatedCurrent: 3A  [WE-CBF_0805_High Current]  (hidden comment: 742792023)
J?#7  691322110002  [691322110002]
J?#8  691322110002  [691322110002]
Q?#8  VNH5180ATR-E  [SSOP50P1030X247-36N]
Q?#9  VNH5180ATR-E  [SSOP50P1030X247-36N]
Q?#10  IRLML2502  [SOT-23]
Q?#11  IRLML2502  [SOT-23]
R?#85  value 10k  [RESC1005X04N]  (hidden comment: RC0402FR-0710KL)
R?#86  value 10k  [RESC1005X04N]  (hidden comment: RC0402FR-0710KL)
R?#87  value 1k  [RESC1005X04N]  (hidden comment: RC0402FR-071KL)
R?#88  value 1k  [RESC1005X04N]  (hidden comment: RC0402FR-071KL)
R?#89  value 1k  [RESC1005X04N]  (hidden comment: RC0402FR-071KL)
R?#90  value 620  [RESC1005X04N]  (hidden comment: RC0402FR-07620RL)
R?#91  value 1k  [RESC1005X04N]  (hidden comment: RC0402FR-071KL)
R?#92  value 1k  [RESC1005X04N]  (hidden comment: RC0402FR-071KL)
R?#93  value 1k  [RESC1005X04N]  (hidden comment: RC0402FR-071KL)
R?#94  value 1k  [RESC1005X04N]  (hidden comment: RC0402FR-071KL)
R?#95  value 1k  [RESC1005X04N]  (hidden comment: RC0402FR-071KL)
R?#96  value 1k  [RESC1005X04N]  (hidden comment: RC0402FR-071KL)
R?#97  value 10k  [RESC1005X04N]  (hidden comment: RC0402FR-0710KL)
R?#98  value 1k  [RESC1005X04N]  (hidden comment: RC0402FR-071KL)
R?#99  value 1k  [RESC1005X04N]  (hidden comment: RC0402FR-071KL)
R?#100  value 1k  [RESC1005X04N]  (hidden comment: RC0402FR-071KL)
R?#101  value 620  [RESC1005X04N]  (hidden comment: RC0402FR-07620RL)
R?#102  value 10k  [RESC1005X04N]  (hidden comment: RC0402FR-0710KL)
R?#103  value 1k  [RESC1005X04N]  (hidden comment: RC0402FR-071KL)
R?#104  value 1k  [RESC1005X04N]  (hidden comment: RC0402FR-071KL)
R?#105  value 1k  [RESC1005X04N]  (hidden comment: RC0402FR-071KL)
R?#106  value 10k  [RESC1005X04N]  (hidden comment: RC0402FR-0710KL)
R?#107  value 1k  [RESC1005X04N]  (hidden comment: RC0402FR-071KL)
R?#108  value 1k  [RESC1005X04N]  (hidden comment: RC0402FR-071KL)
R?#109  value 10k  [RESC1005X04N]  (hidden comment: RC0402FR-0710KL)
R?#110  value 10k  [RESC1005X04N]  (hidden comment: RC0402FR-0710KL)

### Ports
ALIM (harness ALIM), CDC-STM (harness CDC-STM)

### Harnesses
CDC-STM: 
ALIM: BattP, BattD, BattC, 12P, 5L, 5P, 3L, GND, PGND

### Nets
3L: D?#1.2 D?#2.2 FB?#5.2 R?#92.2 R?#93.2 R?#102.2 R?#104.2 R?#105.2 R?#106.2
BattP: C?#20.2 C?#22.2 Q?#8.13(Vcc) Q?#8.24(Vcc) Q?#8.37(Vcc) Q?#9.13(Vcc) Q?#9.24(Vcc) Q?#9.37(Vcc)
GND: C?#19.1 C?#21.1 D?#1.1 D?#2.1 Q?#10.2(S) Q?#11.2(S) R?#85.1 R?#90.1 R?#96.1 R?#101.1 R?#109.1 R?#110.1 ; port ALIM.GND
PGND: C?#20.1 C?#22.1 Q?#8.3(GND_A) Q?#8.4(GND_A) Q?#8.6(GND_A) Q?#8.7(GND_A) Q?#8.30(GND_B) Q?#8.31(GND_B) Q?#8.33(GND_B) Q?#8.34(GND_B) Q?#9.3(GND_A) Q?#9.4(GND_A) Q?#9.6(GND_A) Q?#9.7(GND_A) Q?#9.30(GND_B) Q?#9.31(GND_B) Q?#9.33(GND_B) Q?#9.34(GND_B) ; port ALIM.PGND
MOT1_N: J?#7.2 Q?#8.25(SOURCE_HSb) Q?#8.26(SOURCE_HSb) Q?#8.27(SOURCE_HSb) Q?#8.29(DRAIN_LSb) Q?#8.35(DRAIN_LSb) Q?#8.39(DRAIN_LSb)
MOT1_P: J?#7.1 Q?#8.2(DRAIN_LSa) Q?#8.8(DRAIN_LSa) Q?#8.10(SOURCE_HSa) Q?#8.11(SOURCE_HSa) Q?#8.12(SOURCE_HSa) Q?#8.38(DRAIN_LSa)
MOT2_N: J?#8.2 Q?#9.25(SOURCE_HSb) Q?#9.26(SOURCE_HSb) Q?#9.27(SOURCE_HSb) Q?#9.29(DRAIN_LSb) Q?#9.35(DRAIN_LSb) Q?#9.39(DRAIN_LSb)
MOT2_P: J?#8.1 Q?#9.2(DRAIN_LSa) Q?#9.8(DRAIN_LSa) Q?#9.10(SOURCE_HSa) Q?#9.11(SOURCE_HSa) Q?#9.12(SOURCE_HSa) Q?#9.38(DRAIN_LSa)
PMPr1_CS: D?#1.3 R?#87.2
PMPr1_DIR: Q?#11.1(G) R?#89.1 R?#110.2
PMPr1_DIR_INV: Q?#11.3(D) R?#91.1 R?#106.1
PMPr1_EN: R?#94.1
PMPr1_PWM: R?#88.1
PMPr2_CS: D?#2.3 R?#98.2
PMPr2_DIR: Q?#10.1(G) R?#100.1 R?#109.2
PMPr2_DIR_INV: Q?#10.3(D) R?#102.1 R?#103.1
PMPr2_EN: R?#107.1
PMPr2_PWM: R?#99.1
NetC?#19_2: C?#19.2 R?#86.2 R?#87.1
NetC?#21_2: C?#21.2 R?#97.2 R?#98.1
NetFB?#5_1: FB?#5.1 ; port ALIM.3L
NetQ?#8_15: Q?#8.15(IN_A) R?#89.2
NetQ?#8_16: Q?#8.16(EN/DIAG_A) R?#92.1 R?#94.2
NetQ?#8_17: Q?#8.17(IN_PWM) R?#88.2
NetQ?#8_19: Q?#8.19(CS) R?#86.1 R?#90.2
NetQ?#8_20: Q?#8.20(CS_DIS) R?#85.2
NetQ?#8_21: Q?#8.21(EN/DIAG_B) R?#93.1 R?#95.1
NetQ?#8_22: Q?#8.22(IN_B) R?#91.2
NetQ?#9_15: Q?#9.15(IN_A) R?#100.2
NetQ?#9_16: Q?#9.16(EN/DIAG_A) R?#104.1 R?#107.2
NetQ?#9_17: Q?#9.17(IN_PWM) R?#99.2
NetQ?#9_19: Q?#9.19(CS) R?#97.1 R?#101.2
NetQ?#9_20: Q?#9.20(CS_DIS) R?#96.2
NetQ?#9_21: Q?#9.21(EN/DIAG_B) R?#105.1 R?#108.1
NetQ?#9_22: Q?#9.22(IN_B) R?#103.2

Not connected (* = marked no-connect by the designer): Q?#8 1(nc) 5(nc) 9(nc) 14(nc) 18(nc) 23(nc) 28(nc) 32(nc) 36(nc); Q?#9 1(nc) 5(nc) 9(nc) 14(nc) 18(nc) 23(nc) 28(nc) 32(nc) 36(nc); R?#95 2; R?#108 2

### Notes on the sheet
- Alim.
- ne pas relier les
- alims non utilisées
- ferrite
- PowerObject
- Locaux
- 22V Propulsion
- 22V Moteur DC
- 22V Capteur
- 5V logique
- 12V puissance
- Netlabel créé pour l'occasion.
- 5V puissance
- 3.3V logique
- masse
- masse puissance
- (near R?#92) 3.3k
- (near R?#93) 3.3k
- Signaux à mettre à jour !!
- (near D?#2) Netlabel créé pour l'occasion.
- (near R?#104) 3.3k
- (near R?#105) 3.3k
- Function title
- Routing note
- Warning note
- Info note
- CAp_Pont_H
- Labels drawn without touching a wire or pin: MAss1_BRK, MAss1_ChA, MAss1_ChB, MAss1_CSense, MAss1_DIR, MAss1_Indx, MAss1_PWM, MAss2_BRK, MAss2_ChA, MAss2_ChB, MAss2_CSense, MAss2_DIR, MAss2_Indx, MAss2_PWM, MTor1_Indx1, MTor1_Indx2, MTor1_PWM, MTor2_Indx1, MTor2_Indx2, MTor2_PWM, PMPr1_DIR, PMPr1_EN, PMPr1_EV1, PMPr1_EV2, PMPr1_PWM, PMPr1_Vac, PMPr2_DIR, PMPr2_EN, PMPr2_EV3, PMPr2_EV4, PMPr2_PWM, PMPr2_Vac

### Library data of the parts
C?#19 C?#21 = WCAP-CSGP, 885012205067: CAP CER 10nF 50V X7R 0402; Manufacturer: Wurth Elektronik; PublishedDate: Aug 2016; ComponentLink1Description: Manufacturer; ComponentLink1URL: http://www.we-online.de; ComponentLink2Description: Datasheet; ComponentLink2URL: http://katalog.we-online.com/pbs/datasheet/885012205067.pdf; Manufacturer Part Number: 885012205067; Value: 10nF; Size: 0402; CeramicType: X7R
C?#20 C?#22 = WCAP-CSGP, 885012206095: as C?#16 on sheet CaP_CDC; PublishedDate: Aug 2016; ComponentLink1Description: Manufacturer; ComponentLink1URL: http://www.we-online.de; ComponentLink2Description: Datasheet; ComponentLink2URL: http://katalog.we-online.com/pbs/datasheet/885012206095.pdf; Manufacturer Part Number: 885012206095; Value: 100nF; Size: 0603; CeramicType: X7R
D?#1 D?#2 = BAT54S-7-F: DIODE ARRAY SCHOTTKY 30V SOT23-3; Manufacturer: Diodes Incorporated; Supplier 1: Farnell; Supplier Part Number 1: 9526510; Manufacturer Part Number: BAT54S-7-F; ComponentLink1URL: https://www.diodes.com/assets/Datasheets/ds11005.pdf; ComponentLink1Description: References
FB?#5 = WE-CBF, 742792023: as FB?#1 on sheet CaP_CDC; PublishedDate: Aug 2016; ComponentLink1Description: Manufacturer; ComponentLink1URL: http://www.we-online.de; ComponentLink2Description: Datasheet; ComponentLink2URL: http://katalog.we-online.de/pbs/datasheet/742792023.pdf; Manufacturer Part Number: 742792023; Size: 0805
J?#7 J?#8 = 691322110002: as J?#6 on sheet CaP_CDC; Supplier 1: Farnell; Manufacturer Part Number: 691322110002; ComponentLink1URL: http://www.we-online.com; Supplier Part Number 1: 1841315; ComponentLink1Description: Manufacturer; ComponentLink2Description: Datasheet; ComponentLink2URL: http://katalog.we-online.de/em/datasheet/6913221100xx.pdf
Q?#8 Q?#9 = VNH5180ATR-E: IC MOTOR DRIVER PAR 36POWERSSO; Manufacturer: STMicroelectronics; Manufacturer Part Number: VNH5180ATR-E; ComponentLink1URL: http://www.st.com/content/ccc/resource/technical/document/datasheet/ce/72/6c/f3/65/47/45/b3/CD00264619.pdf/files/CD00264619.pdf/jcr:content/translations/en.CD00264619.pdf; ComponentLink1Description: Datasheet; Supplier 1: Digi-Key; Supplier Part Number 1: 497-13075-6-ND
Q?#10 Q?#11 = IRLML2502: MOSFET CANAL N SOT-23; Manufacturer 1: INTERNATIONAL RECTIFIER; Manufacturer Part Number: IRLML2502PBF; ComponentLink1Description: Datasheet; ComponentLink1URL: http://www.farnell.com/datasheets/1912230.pdf; Supplier 1: Farnell; Supplier Part Number 1: 9102981
R?#85 R?#86 R?#97 R?#102 R?#106 R?#109 R?#110 = RC0402FR-0710KL: as R?#51 on sheet CaP_CDC; Type: Thick Film; ComponentLink1Description: Manufacturer; ComponentLink1URL: http://www.yageo.com/NewPortal/_en/index.jsp; ComponentLink2Description: Datasheet; ComponentLink2URL: http://www.farnell.com/datasheets/2167052.pdf; Supplier 1: Farnell; Supplier Part Number 1: 9239359; Manufacturer Part Number: RC0402FR-0710KL; Precision: ±1%
R?#87-R?#89 R?#91-R?#96 R?#98-R?#100 R?#103-R?#105 R?#107 R?#108 = RC0402FR-071KL: as R?#48 on sheet CaP_CDC; Type: Thick Film; ComponentLink1Description: Manufacturer; ComponentLink1URL: http://www.yageo.com/NewPortal/_en/index.jsp; ComponentLink2Description: Datasheet; ComponentLink2URL: http://www.farnell.com/datasheets/2167052.pdf; Manufacturer Part Number: RC0402FR-071KL; Supplier 1: Farnell; Supplier Part Number 1: 9239235; Precision: ±1%
R?#90 R?#101 = RC0402FR-07620RL: RES SMD 620 OHM 1% 1/16W 0402; Manufacturer: Yageo; Power: 63mW; Vmax: 50V; Type: Thick Film; ComponentLink1Description: Manufacturer; ComponentLink1URL: http://www.yageo.com/NewPortal/_en/index.jsp; ComponentLink2Description: Datasheet; ComponentLink2URL: http://www.farnell.com/datasheets/2167052.pdf; Manufacturer Part Number: RC0402FR-07620RL; Precision: ±1%; Supplier 1: Farnell; Supplier Part Number 1: 1458815

## Nets that join several sheets
3L: CaP_PWR (9 pins), CaP_SRV (12 pins), CaP_CDC (13 pins), CaP_STM (D1.8 FB?#4.2 J1.1), CAp_Pont_H (9 pins)
5L: CaP_PWR (7 pins), CaP_CDC (9 pins), CaP_STM (FB2.1)
5P: CaP_PWR (7 pins), CaP_SRV (C?#5.1 L?#1.1 L?#2.1), CaP_CDC (FB?#2.2 R?#59.2 R?#67.2)
BattD: CaP_PWR (D11.2), CaP_CDC (8 pins)
GND: CaP_PWR (12 pins), CaP_SRV (8 pins), CaP_CDC (28 pins), CaP_STM (6 pins), CAp_Pont_H (12 pins)
PGND: CaP_PWR (46 pins), CaP_SRV (25 pins), CaP_STM (D1.7 J1.3 J1.5 J1.9), CAp_Pont_H (18 pins)